# EAGLE design Mussel_heartrate_RevC (EAGLE 9.5.2)
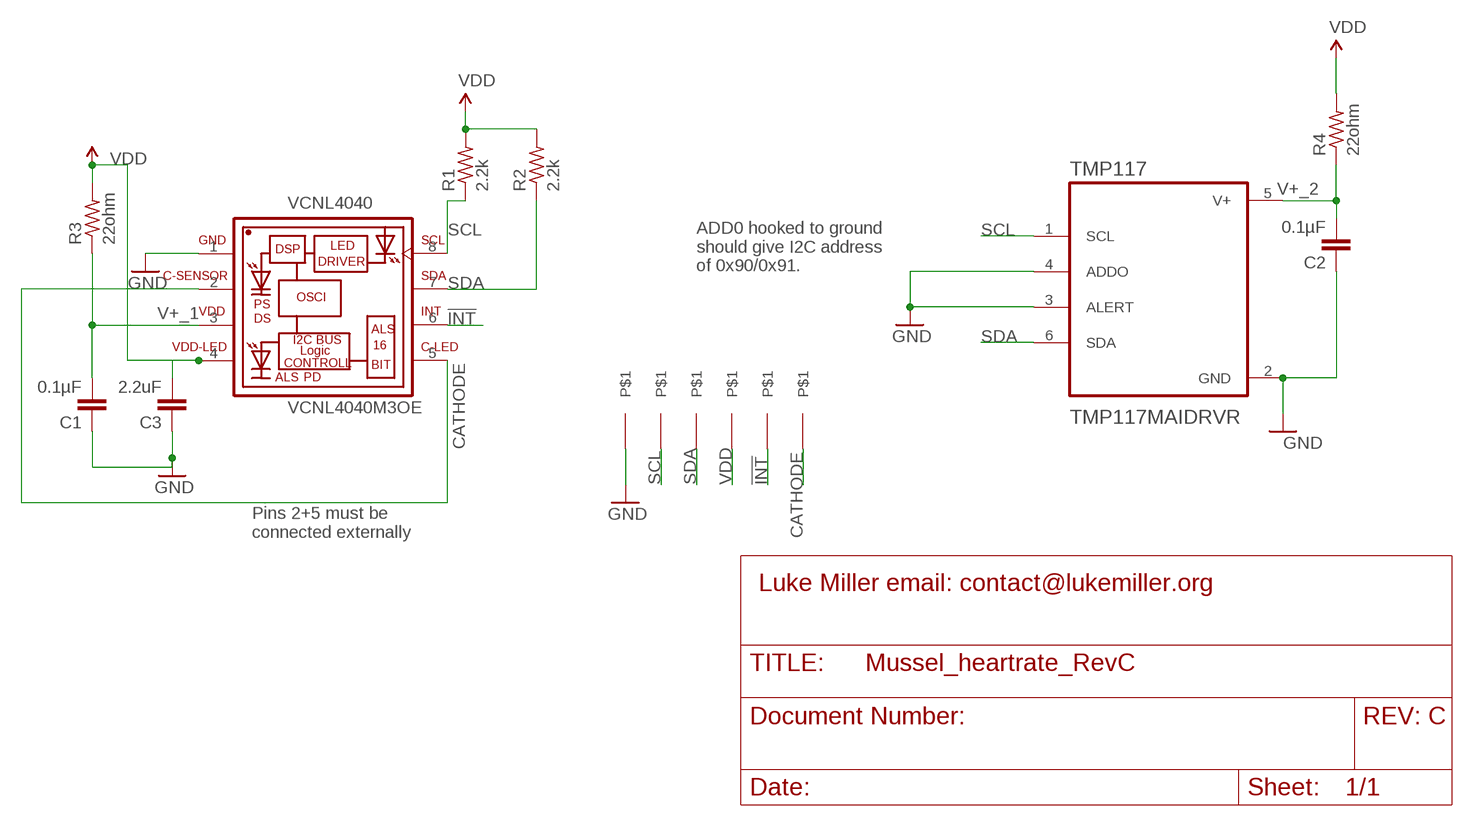
[diagram p0: schematic, sheet 1]

## Parts
!INT  PINHD-1X10.7MM_DRILL  [1X01_SMALL_0.7]
!INT1  PINHD-1X10.7MM_DRILL  [1X01_SMALL_0.7]
C1  0.1µF  CAP0402  [C0402]
C2  0.1µF  CAP0402  [C0402]
C3  2.2uF  CAP0402  [C0402]
GND  PINHD-1X1SMALL  [1X01_SMALL]
R1  2.2k  RESISTOR_SMDR0402  [R0402]
R2  2.2k  RESISTOR_SMDR0402  [R0402]
R3  22ohm  RESISTOR_SMDR0402  [R0402]
R4  22ohm  RESISTOR_SMDR0402  [R0402]
SCL  PINHD-1X1SMALL  [1X01_SMALL]
SDA  PINHD-1X1SMALL  [1X01_SMALL]
TMP117  TMP117MAIDRVR  [SON65P200X200X80-7N]
VCNL4040  VCNL4040M3OE  [VISHAY_VCNL4040_4X2X1.1]
VDD  PINHD-1X1SMALL  [1X01_SMALL]

## Nets
!INT: !INT.P$1 VCNL4040.6(INT)
CATHODE: !INT1.P$1 VCNL4040.2(C-SENSOR) VCNL4040.5(C-LED)
GND: C1.1 C2.1 C3.1 GND.1 TMP117.2(GND) TMP117.3(ALERT) TMP117.4(ADDO) VCNL4040.1(GND)
SCL: R1.1 SCL.1 TMP117.1(SCL) VCNL4040.8(SCL)
SDA: R2.1 SDA.1 TMP117.6(SDA) VCNL4040.7(SDA)
V+_1: C1.2 R3.1 VCNL4040.3(VDD)
V+_2: C2.2 R4.1 TMP117.5(V+)
VDD: C3.2 R1.2 R2.2 R3.2 R4.2 VCNL4040.4(VDD-LED) VDD.1 ; supply symbol labelled VCC

## Notes on the sheet
- ADD0 hooked to ground 
  should give I2C address 
  of 0x90/0x91.
- Pins 2+5 must be
  connected externally

## Library data of the parts
!INT !INT1 GND SCL SDA VDD = miller:PINHD-1X1: Just a single pin header, useful for making test point or stand-alone header hole for normal 0.1" pitch through-hole header pins The SMALL footprint is 0.035" diameter, barely large enough for standard 0.1" pitch header pins. The SMALL_0.7 footprint is 1.056mm diameter, drill hole is 0.7mm, too small for 0.1" pitch header pins
C1-C3 = miller:CAP: Capacitor Standard surface mount ceramic capacitor and 0.1" leaded capacitor.
R1-R4 = miller:RESISTOR_SMD: RESISTOR, American symbol
TMP117 = miller:TMP117MAIDRVR: TMP117 temperature sensor, +/- 0.1C accuracy.; AVAILABILITY: Warning; DESCRIPTION: 0.1C accurate digital temperature sensor with integrated NV memory 6-WSON 0 to 85; MF: Texas Instruments; MP: TMP117MAIDRVR; PACKAGE: WSON-6 Texas Instruments; PRICE: None; PURCHASE-URL: https://pricing.snapeda.com/search/part/TMP117MAIDRVR/?ref=eda
VCNL4040 = miller:VCNL4040M3OE: VCNL4040 Fully Integrated Proximity and Ambient Light Sensor with Infrared Emitter, I2C Interface, and Interrupt Function: VCNL4040 integrates a proximity sensor (PS), ambient light sensor (ALS), and a high power IRED into one small package. It incorporates photodiodes, amplifiers, and analog to digital converting circuits into a single chip by CMOS process. The 16-bit high resolution ALS offers excellent sensing capabilities with sufficient selections to fulfill most applications whether dark or high transparency lens design. High and low interrupt thresholds can be programmed for both ALS and PS, allowing the component to use a minimal amount of the microcontrollers resources. Device Model created 15.06.2016 by Johannes Kolb - Vishay Semiconductor GmbH Check prices <https://pricing.snapeda.com/parts/VCNL4040M3OE/Vishay/view-part?ref=eda>; AVAILABILITY: Good; DESCRIPTION: Optical Sensor Ambient 550nm I²C 8-SMD Module; MF: Vishay; MP: VCNL4040M3OE; PACKAGE: SMD-8 Vishay; PRICE: None; PURCHASE-URL: https://pricing.snapeda.com/search/part/VCNL4040M3OE/?ref=eda

## Board
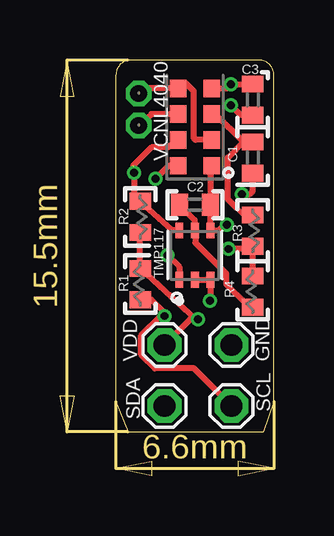
[diagram p1: board, top side]
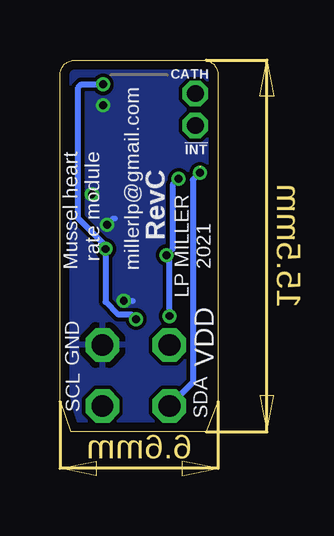
[diagram p2: board, bottom side, seen from below]

Size 6.6 x 15.49 mm. Coordinates in mm from the lower left corner, seen from the top.
Outline: 0.51,0 6.16,0 6.6,1.27 6.6,14.86 arc90 5.97,15.49 0.64,15.49 arc90 0,14.86 0,1.27 0.51,0
Copper layers (1*16): Top 0.035559375mm / dielectric 1.6mm / Bottom 0.035559375mm
Design rules "oshpark-2layer *": minimum track width 6mil, minimum drill 10mil, track to track 6mil, track to pad 6mil, pad to pad 6mil, via to via 6mil, smd to smd 6mil, copper to edge 15mil, drill to drill 6mil, minimum pad ring 5mil, minimum via ring 5mil, stop-mask expansion 2.5mil, vias tented up to drill 25mil, thermal gap 10mil

### Footprints (pad centres in the part's own frame; a part is rotated, then mirrored left to right if it is on the bottom)
1X01_SMALL_0.7 = drill 0.7 pad 1.057 octagon: P$1 0,0
C0402 = smd 0.7 x 0.9: 1 -0.65,0; 2 0.65,0
1X01_SMALL = drill 0.9 pad 1.397 octagon: 1 0,0
R0402 = smd 0.7 x 0.9: 1 -0.65,0; 2 0.65,0
SON65P200X200X80-7N = smd 0.66 x 0.32: 1 -1.025,0.65; 2 -1.025,0; 3 -1.025,-0.65; 4 1.025,-0.65; 5 1.025,0; 6 1.025,0.65
VISHAY_VCNL4040_4X2X1.1 = smd 0.7 x 0.725: 1 -0.7,1.613; 2 -0.7,0.537; 3 -0.7,-0.537; 4 -0.7,-1.613; 5 0.7,-1.613; 6 0.7,-0.537; 7 0.7,0.537; 8 0.7,1.613

### Placement (x,y rotation side)
!INT  0.95,12.76 0 top
!INT1  0.95,14.1 0 top
C1  5.71,11.43 90 top
C2  3.3,9.46 180 top
C3  5.71,13.84 90 top
GND  4.83,3.62 0 top
R1  1.02,6.16 90 top
R2  1.02,8.95 270 top
R3  5.71,8.38 270 top
R4  5.71,5.84 90 top
SCL  4.83,1.08 0 top
SDA  2.03,1.08 0 top
TMP117  3.3,7.37 90 top
VCNL4040  3.3,12.7 180 top
VDD  2.03,3.62 0 top

### Tracks (layer width: path | path; a pad name or v marks a point on that pad's centre or on a via)
!INT
  Top 0.254: VCNL4040.6 1.49,13.24 !INT.P$1
CATHODE
  Top 0.254: VCNL4040.2 3.33,12.16 3.25,12.25 3.25,14.21 2.94,14.51 2.68,14.51 VCNL4040.5 1.23,14.31 !INT1.P$1
GND  (via drill 0.33)
  Top 0.254: VCNL4040.1 3.87,10.83 3.95,10.76 C2.1 | 3.95,9.59 C2.1 | C2.1 TMP117.4 4.3,8.39 4.54,8.64 v4.63,8.64 | v3.94,5.46 3.95,5.48 TMP117.3 TMP117.2 | v5.27,9.91 5.59,9.91 5.71,10.03 C1.1 | C3.1 5.22,13.19 v4.8,13.61
  Bottom 0.254: v4.63,8.64 4.38,8.89 4.32,8.89 | v3.94,5.46 3.56,5.46 | v4.8,13.61 4.7,13.72 | 4.7,13.72 | v5.27,9.91 5.44,9.91
  pour Bottom: 0,1.27 0,14.86 arc-90 0.64,15.49 5.97,15.49 arc-90 6.6,14.86 6.6,1.27 6.16,0 0.51,0
SCL  (via drill 0.33)
  Top 0.254: v2.16,7.37 2.65,6.87 TMP117.1 | VCNL4040.8 2.2,11.09 v1.65,10.54 | SCL.1 3.26,2.64 1.63,2.64 1.05,3.21 1.05,4.03 1.86,4.83 v2.03,4.83 2.03,4.95 1.48,5.51 R1.1
  Bottom 0.254: v1.65,10.54 1.9,10.29 1.9,7.62 v2.16,7.37 2.03,7.24 v2.03,4.83
SDA  (via drill 0.33)  (1 unrouted)
  Top 0.254: VCNL4040.7 2.17,11.86 1.5,11.86 0.73,11.08 | 0.76,11.05 v0.76,10.79 0.76,9.86 R2.1 2.36,8.39 TMP117.6
  Bottom 0.254: v0.76,10.79 1.05,10.5 1.05,2.06 SDA.1
V+_1
  Top 0.178: R3.1 5.34,9.03 5.03,9.34
  Top 0.254: 5.32,12.08 4.67,11.43 4.67,9.7 5.03,9.34 | 5.32,12.08 C1.2 | 5.32,12.08 4.16,13.24 VCNL4040.3
V+_2
  Top 0.254: C2.2 3.29,8.83 3.29,8.53 3.3,8.52 TMP117.5 3.32,8.37 3.32,7.88 4.61,6.6 4.61,6.15 5.46,5.3 R4.1
VDD  (via drill 0.33)
  Top 0.254: VDD.1 3.11,4.7 v3.43,4.7 3.32,4.7 R1.2 R2.2 | C3.2 4.82,14.49 v4.8,14.48 4.65,14.31 VCNL4040.4 | v4.7,7.62 5.41,7.62 R3.2 R4.2
  Bottom 0.254: v3.43,4.7 3.62,4.89 4.17,4.89 4.7,5.42 v4.7,7.62 4.7,7.75 5.84,8.89 5.84,14.35 5.71,14.48 v4.8,14.48

### Text on the board
bPlace: CATH | !INT | Mussel heart / rate module | RevC | LP MILLER / 2021 | millerlp@gmail.com | GND | VDD | SDA | SCL